# Altium schematic sheet Main.SchDoc: Наименование
size 420 x 297 mm; ApprovedBy: Сидоров; CheckedBy: Петров; Author: Иванов; CompanyName: РГППУ; Title2str: Изделия; DecimalNumber: АБВГ.123456.001 33
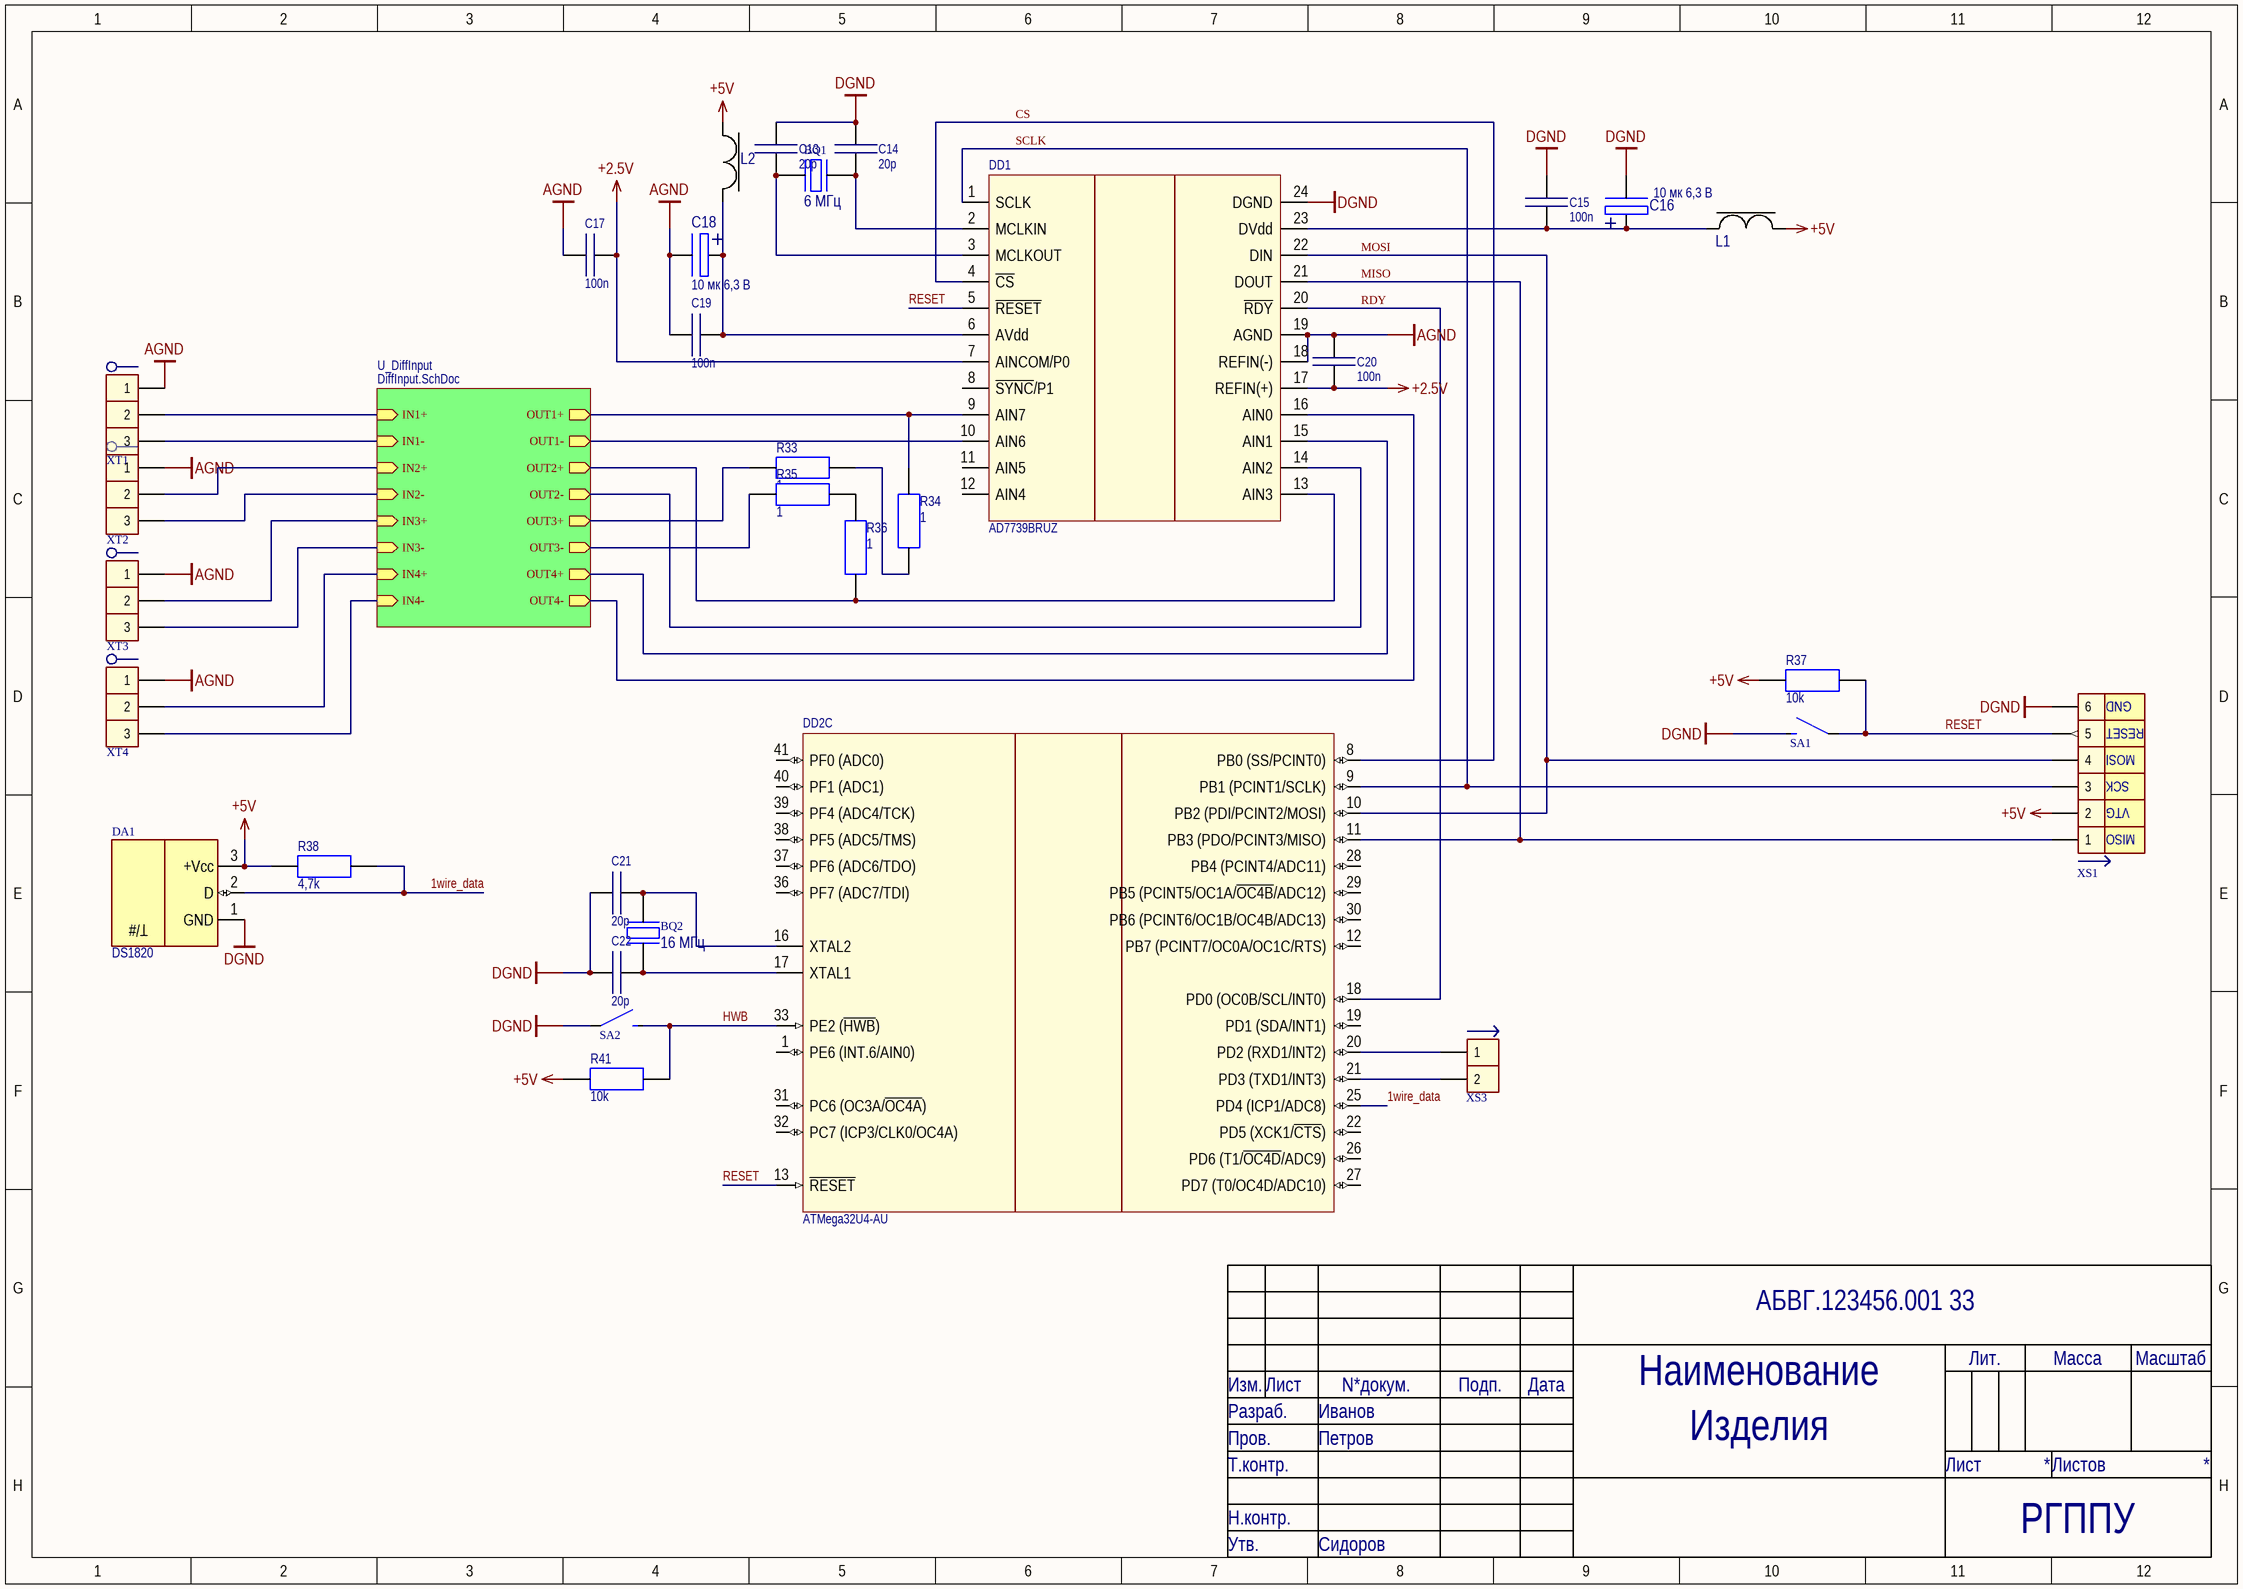
[diagram p0: Main.SchDoc]

## Parts
BQ1  6 МГц  [HC-49/S]
BQ2  16 МГц  [HC-49/S]
C13  20p  [SMDRC0805]
C14  20p  [SMDRC0805]
C15  100n  [SMDRC0805]
C16  value 10 мк 6,3 В  [К50-6]  (hidden comment: К-50-6)
C17  100n  [SMDRC0805]
C18  value 10 мк 6,3 В  [К50-6]  (hidden comment: К-50-6)
C19  100n  [SMDRC0805]
C20  100n  [SMDRC0805]
C21  20p  [SMDRC0805]
C22  20p  [SMDRC0805]
DA1  DS1820  [L78L09]
DD1  AD7739BRUZ  [TSSOP-RU-24]
DD2  ATMega32U4-AU  [44ML_L]  (part C of 3)
L1  MPZ1608S181A  [INDC0603X03M]  (value not drawn)
L2  MPZ1608S181A  [INDC0603X03M]  (value not drawn)
R33  1  [SMDRC0805]
R34  1  [SMDRC0805]
R35  1  [SMDRC0805]
R36  1  [SMDRC0805]
R37  10k  [SMDRC0805]
R38  4,7k  [SMDRC0805]
R41  10k  [SMDRC0805]
SA1  DTSM20-4.3  [DTSM20]  (value not drawn)
SA2  DTSM20-4.3  [DTSM20]  (value not drawn)
XS1  IDC-06M  [IDC-06M]  (value not drawn)
XS3  PLS-02  [PLS-02]  (value not drawn)
XT1  330-031-12  [330-031-12]  (value not drawn)
XT2  330-031-12  [330-031-12]  (value not drawn)
XT3  330-031-12  [330-031-12]  (value not drawn)
XT4  330-031-12  [330-031-12]  (value not drawn)

## Sub-sheets
U_DiffInput = DiffInput.SchDoc: IN1+ (in), IN1- (in), IN2+ (in), IN2- (in), OUT1+ (out), OUT1- (out), OUT2+ (out), OUT2- (out), IN3+ (in), IN3- (in), IN4+ (in), IN4- (in), OUT3+ (out), OUT3- (out), OUT4+ (out), OUT4- (out)

## Nets
+2.5V: C17.2 C20.1 DD1.7(AINCOM/P0) DD1.17(REFIN(+))
+5V: DA1.3(+Vcc) L1.2 L2.1 R37.2 R38.2 R41.2 XS1.2
AGND: C17.1 C18.1(-) C19.2 C20.2 DD1.18(REFIN(-)) DD1.19(AGND) XT1.1 XT2.1 XT3.1 XT4.1
DGND: C13.1 C14.1 C15.2 C16.1(-) C21.1 C22.1 DA1.1(GND) DD1.24(DGND) SA1.2 SA2.1 XS1.6
1wire_data: DA1.2(D) DD2.25(PD4_(ICP1/ADC8)) R38.1
CS: DD1.4(~{CS}) DD2.8(PB0_(SS/PCINT0))
HWB: DD2.33(PE2_(~{HWB})) R41.1 SA2.2
MISO: DD1.21(DOUT) DD2.11(PB3_(PDO/PCINT3/MISO)) XS1.1
MOSI: DD1.22(DIN) DD2.10(PB2_(PDI/PCINT2/MOSI)) XS1.4
RDY: DD1.20(~{RDY}) DD2.18(PD0_(OC0B/SCL/INT0))
RESET: DD1.5(~{RESET}) DD2.13(~{RESET}) R37.1 SA1.1 XS1.5
SCLK: DD1.1(SCLK) DD2.9(PB1_(PCINT1/SCLK)) XS1.3
NetBQ1_1: BQ1.1 C13.2 DD1.3(MCLKOUT)
NetBQ1_2: BQ1.2 C14.2 DD1.2(MCLKIN)
NetBQ2_1: BQ2.1 C22.2 DD2.17(XTAL1)
NetBQ2_2: BQ2.2 C21.2 DD2.16(XTAL2)
NetC15_1: C15.1 C16.2(+) DD1.23(DVdd) L1.1
NetC18_2: C18.2(+) C19.1 DD1.6(AVdd) L2.2
NetDD1_9: DD1.9(AIN7) R34.2 ; sheet U_DiffInput/OUT1+
NetDD1_10: DD1.10(AIN6) ; sheet U_DiffInput/OUT1-
NetDD1_13: DD1.13(AIN3) R36.1 ; sheet U_DiffInput/OUT2+
NetDD1_14: DD1.14(AIN2) ; sheet U_DiffInput/OUT2-
NetDD1_15: DD1.15(AIN1) ; sheet U_DiffInput/OUT4+
NetDD1_16: DD1.16(AIN0) ; sheet U_DiffInput/OUT4-
NetDD2_20: DD2.20(PD2_(RXD1/INT2)) XS3.1
NetDD2_21: DD2.21(PD3_(TXD1/INT3)) XS3.2
NetR33_1: R33.1 ; sheet U_DiffInput/OUT3+
NetR33_2: R33.2 R34.1
NetR35_1: R35.1 ; sheet U_DiffInput/OUT3-
NetR35_2: R35.2 R36.2
NetXT1_2: XT1.2 ; sheet U_DiffInput/IN1+
NetXT1_3: XT1.3 ; sheet U_DiffInput/IN1-
NetXT2_2: XT2.2 ; sheet U_DiffInput/IN2+
NetXT2_3: XT2.3 ; sheet U_DiffInput/IN2-
NetXT3_2: XT3.2 ; sheet U_DiffInput/IN3+
NetXT3_3: XT3.3 ; sheet U_DiffInput/IN3-
NetXT4_2: XT4.2 ; sheet U_DiffInput/IN4+
NetXT4_3: XT4.3 ; sheet U_DiffInput/IN4-

Not connected (* = marked no-connect by the designer): DD1 8(~{SYNC}/P1) 11(AIN5) 12(AIN4); DD2 1(PE6_(INT.6/AIN0)) 12(PB7_(PCINT7/OC0A/OC1C/RTS)) 19(PD1_(SDA/INT1)) 22(PD5_(XCK1/~{CTS})) 26(PD6_(T1/~{OC4D}/ADC9)) 27(PD7_(T0/OC4D/ADC10)) 28(PB4_(PCINT4/ADC11)) 29(PB5_(PCINT5/OC1A/~{OC4B}/ADC12)) 30(PB6_(PCINT6/OC1B/OC4B/ADC13)) 31(PC6_(OC3A/~{OC4A})) 32(PC7_(ICP3/CLK0/OC4A)) 36(PF7_(ADC7/TDI)) 37(PF6_(ADC6/TDO)) 38(PF5_(ADC5/TMS)) 39(PF4_(ADC4/TCK)) 40(PF1_(ADC1)) 41(PF0_(ADC0))

## Notes on the sheet
- Изм.
- Лист
- N*докум.
- Подп.
- Дата
- Лит.
- Масса
- Масштаб
- Разраб.
- Пров.
- Т.контр.
- Лиcт
- Лиcтов
- Н.контр.
- Утв.
- (in symbol Con6_M IDC-06M_SPI) GND; RESET; MOSI; SCK; VTG; MISO
- (in symbol T_DS1820) T/#

## Library data of the parts
BQ1 = Piezoelectric_6000: Piezoelectric elements; Manufacturer: Taizhou; ManufacturerPartNumber: 6000 кГц; Notes: 20ppm 20pF; ComponentLink1URL: http://www.promelec.ru/catalog_info/54/126/246/70/; ComponentLink1Description: Datasheet; Package: HC-49/S; Cost: 10; Supplier: Промэлектроника; ComponentLink2Description: Datasheet-local; Value: 6 МГц
BQ2 = Piezoelectric_16000: Piezoelectric elements; Manufacturer: Taizhou; ManufacturerPartNumber: 16000 кГц 20ppm 20pF; ComponentLink1URL: http://www.promelec.ru/catalog_info/54/126/246/70/; ComponentLink1Description: Datasheet; Package: HC-49/S; Cost: 8,54; Supplier: Промэлектроника; ComponentLink2Description: Datasheet-local; Value: 16 МГц
C13 C14 C21 C22 = Capacitor 0805 20p: Generic capasitor non-polar; PartNumber: Capacitor 0805 20p; Value: 20p; ComponentLink1Description: Datasheet; Package: 0805
C15 C17 C19 C20 = Capacitor 0805 100n: Generic capasitor non-polar; PartNumber: Capacitor 0805 100n; Value: 100n; ComponentLink1Description: Datasheet; Package: 0805
C16 C18 = 10000_006-К50: 10uF 6,3V Polar through-hole cap; ManufacturerPartNumber: К-50-6; Supplier: -; Cost: -; Package: штырьевой; ComponentLink1Description: Datasheet; ComponentLink2Description: Datasheet-local
DA1 = T_DS1820: Precision Micropower Shunt Voltage Reference; Manufacturer: Dallas Semiconductor; Package: TO-92; ComponentLink1URL: http://datasheets.maximintegrated.com/en/ds/DS18B20-PAR.pdf; ComponentLink1Description: Datasheet; ComponentLink2Description: Datasheet-local; ManufacturerPartNumber: DS1820
DD1 = AD7739: IC ADC 24BIT 8-CH 24-TSSOP; Manufacturer: Analog Devices Inc.; Number of Bits: 24; Sampling Rate (Per Second): 15.1k; Number of Inputs: 4, 8; Input Type: Differential, Single Ended; Data Interface: SPI, DSP; Configuration: MUX-ADC; Number of A/D Converters: 1; Architecture: Sigma-Delta; Reference Type: External; Voltage - Supply, Analog: 5V; Voltage - Supply, Digital: 2.7 V ~ 3.6 V, 5V; ManufacturerPartNumber: AD7739BRUZ; Supplier 1: Digi-Key; Manufacturer Part Number: AD7739BRUZ; RoHS: RoHS Compliant; Category: Integrated Circuits (ICs); Stock 1: 284; Pricing 1: 1=15.82, 62=13.93694, 124=12.2796, 558=10.92357, 1054=10.01955, 2542=9.64288, 5000=9.516 (USD); Packaging: Tube; Ratio - S/H:ADC: -; Features: True Bipolar; Operating Temperature: -40°C ~ 105°C; Package / Case: 24-TSSOP (0.173", 4.40mm Width); Supplier Device Package: 24-TSSOP; ComponentLink1URL: http://www.analog.com/media/en/technical-documentation/data-sheets/AD7739.pdf; ComponentLink1Description: http://www.analog.com/media/en/technical-documentation/data-sheets/AD7739.pdf; Supplier Part Number 1: AD7739BRUZ-ND
DD2 = ATMega32U4: ManufacturerPartNumber: ATMega32U4-AU
L1 L2 = Ferrite Bead: Value: ? мГн; ManufacturerPartNumber: MPZ1608S181A; ComponentLink1Description: Datasheet; Supplier: Промэлектроника; ComponentLink2Description: Datasheet-local; ComponentLink2URL: *
R33-R36 = Resistor 0805 1: Generic resistor; PartNumber: Resistor 0805 1; Value: 1; ComponentLink1URL: http://www.mouser.com/ds/2/447/PYu-RC0402_51_RoHS_L_6_r-8721.pdf; ComponentLink1Description: Datasheet; Package: 0805
R37 R41 = Resistor 0805 10k: Generic resistor; PartNumber: Resistor 0805 10k; Value: 10k; ComponentLink1URL: http://www.mouser.com/ds/2/447/PYu-RC0402_51_RoHS_L_6_r-8721.pdf; ComponentLink1Description: Datasheet; Package: 0805
R38 = Resistor 0805 4,7k: Generic resistor; PartNumber: Resistor 0805 4,7k; Value: 4,7k; ComponentLink1URL: http://www.mouser.com/ds/2/447/PYu-RC0402_51_RoHS_L_6_r-8721.pdf; ComponentLink1Description: Datasheet; Package: 0805
SA1 SA2 = Switch1_DTSM20-4.3: Switch open; Manufacturer: Diptronics; ManufacturerPartNumber: DTSM20-4.3; ComponentLink1Description: Datasheet; ComponentLink1URL: http://www.promelec.ru/catalog/407/1291/1323/1/70721/; ComponentLink2Description: Datasheet-local; ComponentLink2URL: *
XS1 = Con6_M IDC-06M_SPI: SPI connector; ManufacturerPartNumber: IDC-06M; ComponentLink1Description: Datasheet; ComponentLink1URL: http://www.promelec.ru/catalog/406/1218/1223/1/156430/; ComponentLink2Description: Datasheet-local; ComponentLink2URL: *
XS3 = Con2_M_PLS-02: Male 2-pin connection; ManufacturerPartNumber: PLS-02; ComponentLink1Description: Datasheet; ComponentLink1URL: http://www.promelec.ru/catalog/406/1218/1224/1/24233/; ComponentLink2Description: Datasheet-local; ComponentLink2URL: *
XT1-XT4 = Con3_D 330-031-12: Demountable connection 3-pin; Manufacturer: Degson Electronics Co., Ltd; ManufacturerPartNumber: 330-031-12; ComponentLink1Description: Datasheet; Cost: 13; Supplier: Промэлектроника; ComponentLink2Description: Datasheet-local